# EasyEDA schematic cube-esp32-c6-easyeda-sch.json
TITLE: Alphabet Blocks; REV: 1.0; Date: 2024-02-08; Sheet: 1/1; Drawn By: stephen5.ng; Company: Stephen Ng
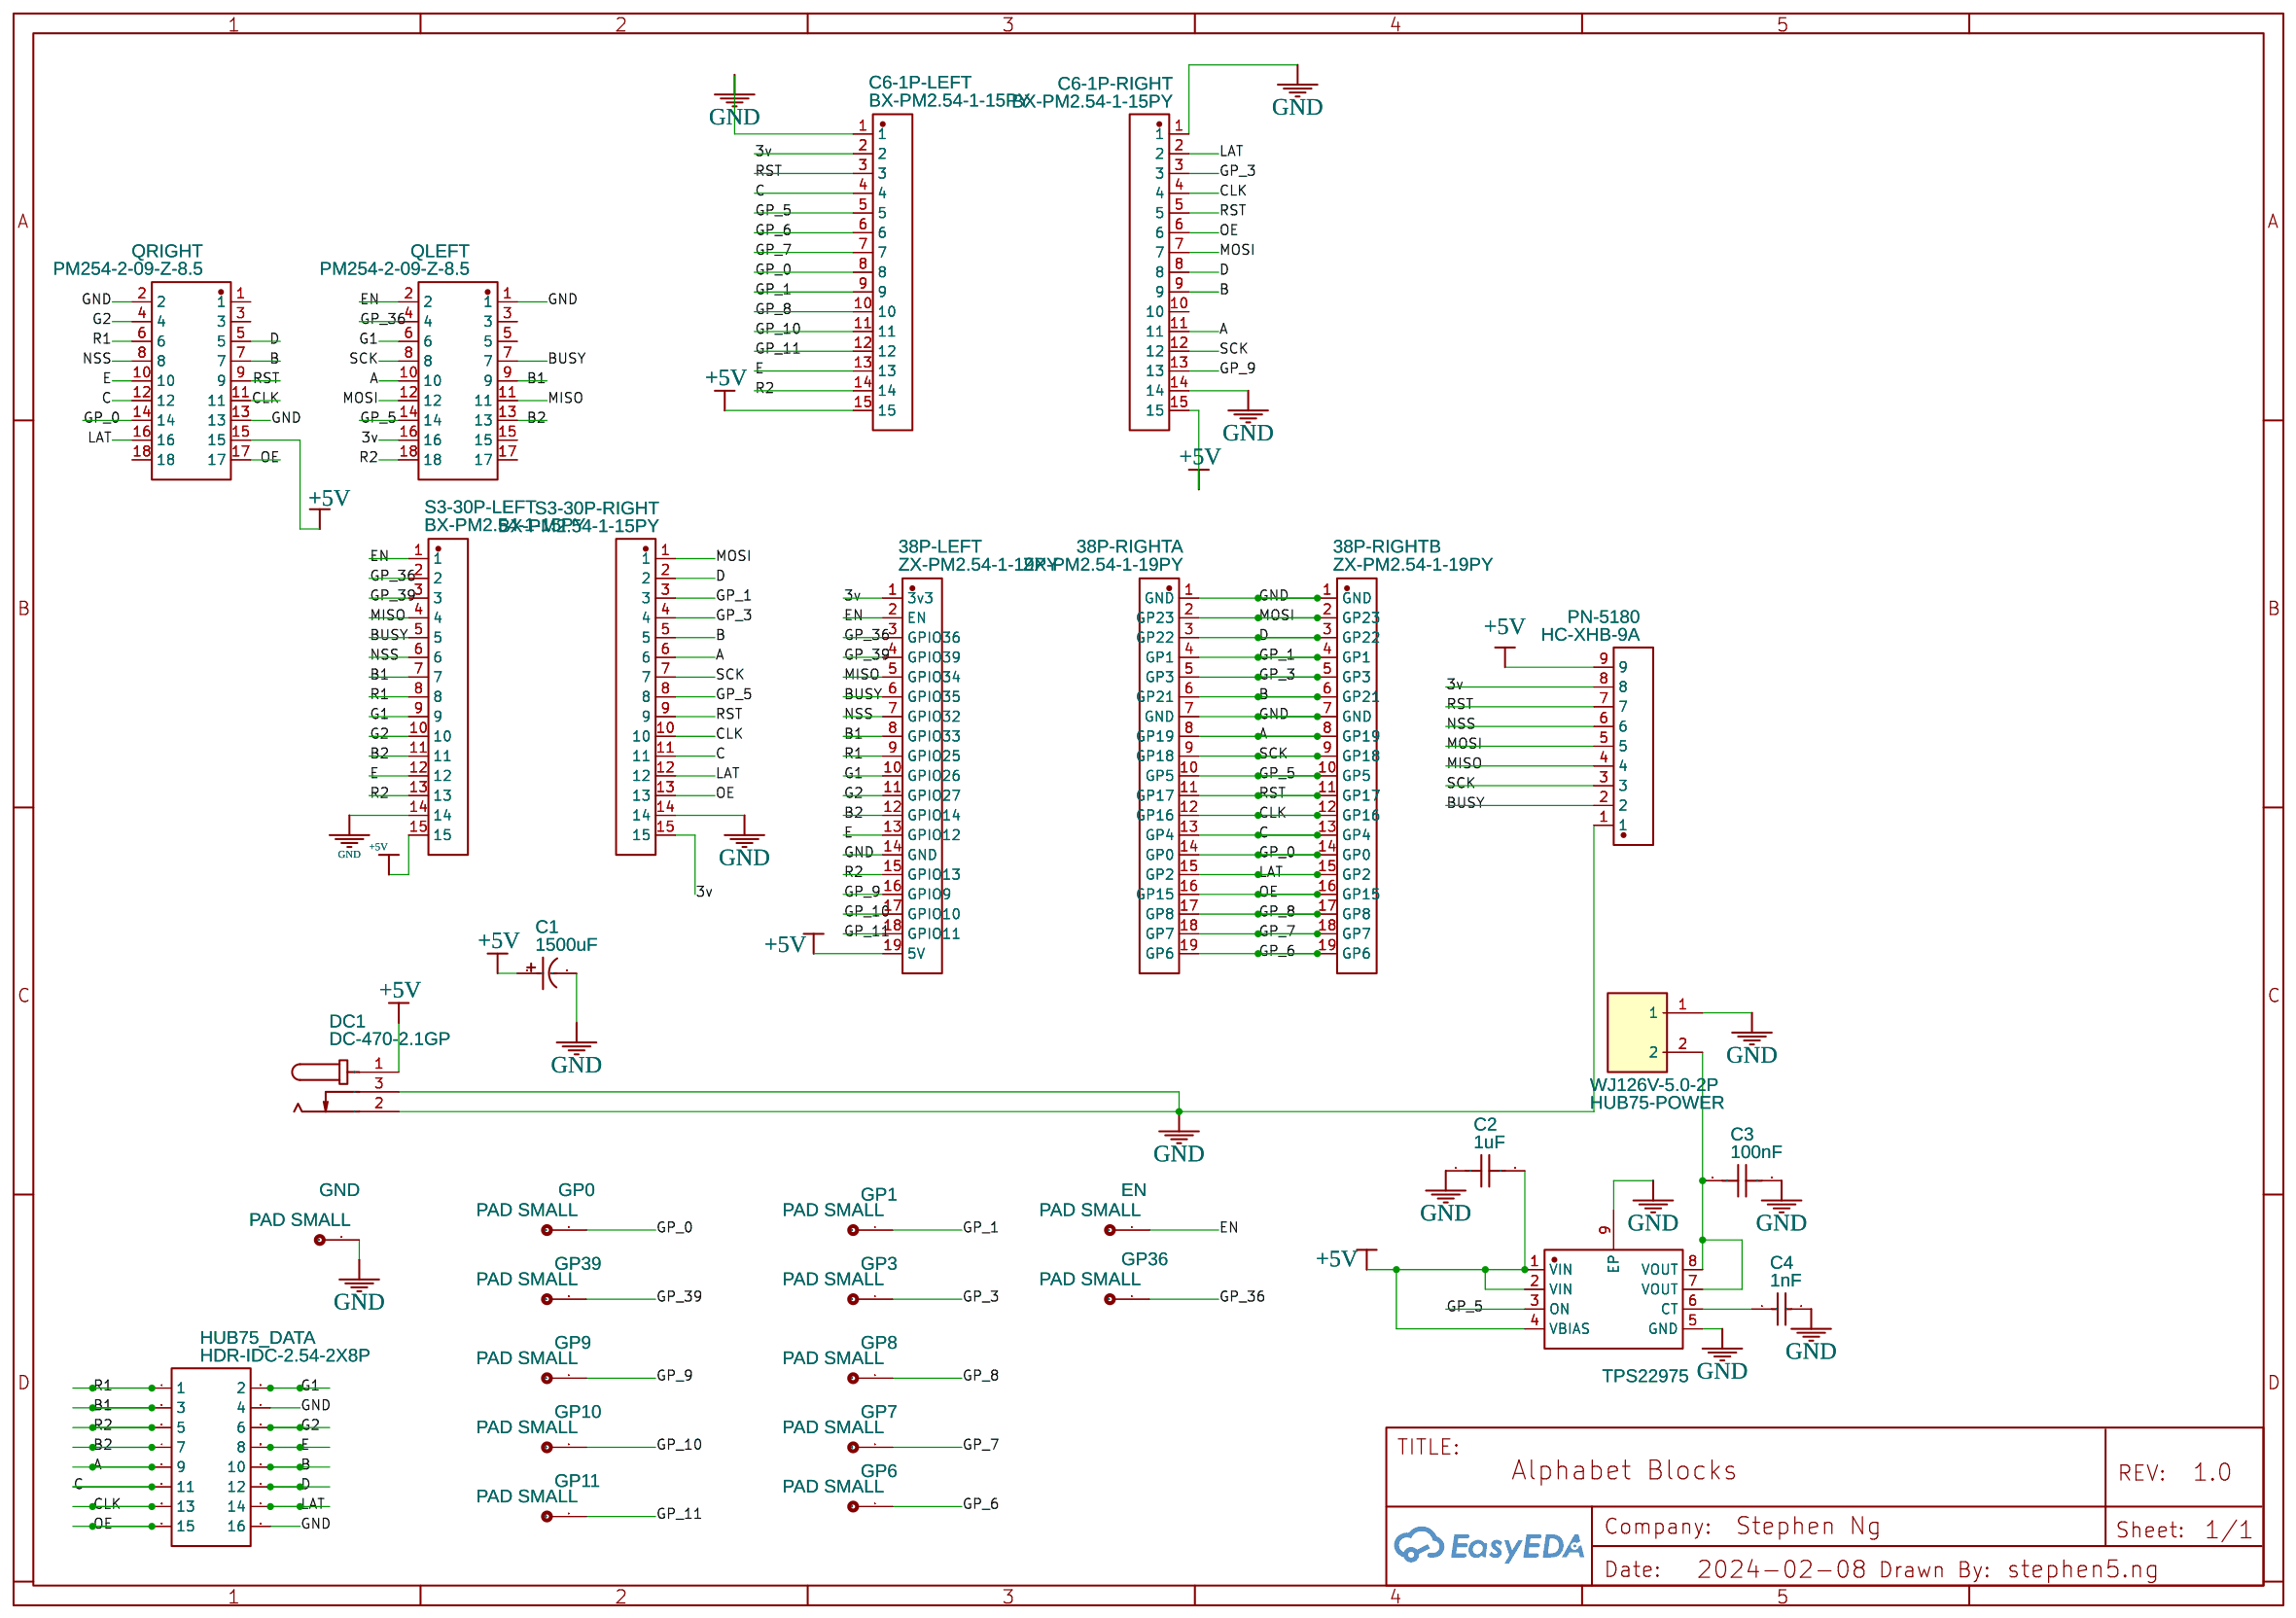
[diagram p0: schematic sheet]

## Parts
38P-LEFT  ZX-PM2.54-1-19PY  [HDR-TH_19P-P2.54-V-F]
38P-RIGHTA  ZX-PM2.54-1-19PY  [HDR-TH_19P-P2.54-V-F]
38P-RIGHTB  ZX-PM2.54-1-19PY  [HDR-TH_19P-P2.54-V-F]
C1  1500uF  [CAP-TH_BD10.0-P5.00-D1.0-FD]
C2  1uF  [C0402]
C3  100nF  [C0402]
C4  1nF  [C0402]
C6-1P-LEFT  BX-PM2.54-1-15PY  [HDR-TH_15P-P2.54-V-F-1]
C6-1P-RIGHT  BX-PM2.54-1-15PY  [HDR-TH_15P-P2.54-V-F-1]
DC1  DC-470-2.1GP  [DC-IN-TH_DC-470-2.1GP]
EN  PAD SMALL  [PADPAD]
GND  PAD SMALL  [PADPAD]
GP0  PAD SMALL  [PADPAD]
GP1  PAD SMALL  [PADPAD]
GP3  PAD SMALL  [PADPAD]
GP6  PAD SMALL  [PADPAD]
GP7  PAD SMALL  [PADPAD]
GP8  PAD SMALL  [PADPAD]
GP9  PAD SMALL  [PADPAD]
GP10  PAD SMALL  [PADPAD]
GP11  PAD SMALL  [PADPAD]
GP36  PAD SMALL  [PADPAD]
GP39  PAD SMALL  [PADPAD]
HUB75-POWER  WJ126V-5.0-2P  [CONN-TH_WJ126V-5.0-2P]
HUB75_DATA  HDR-IDC-2.54-2X8P  [IDC-TH_16P-P2.54_C3406]
PN-5180  HC-XHB-9A  [CONN-TH_9P_P2.50_HCTL_HC-XHB-9A]
QLEFT  PM254-2-09-Z-8.5  [HDR-TH_18P-P2.54-V-F-R2-C9-S2.54]
QRIGHT  PM254-2-09-Z-8.5  [HDR-TH_18P-P2.54-V-F-R2-C9-S2.54]
S  TPS22975  [WSON-8_L2.0-W2.0-P0.50-TL-EP]
S3-30P-LEFT  BX-PM2.54-1-15PY  [HDR-TH_15P-P2.54-V-F-1]
S3-30P-RIGHT  BX-PM2.54-1-15PY  [HDR-TH_15P-P2.54-V-F-1]

## Library data of the parts
38P-LEFT 38P-RIGHTA 38P-RIGHTB = ZX-PM2.54-1-19PY: Supplier: LCSC; Supplier Part: C7499335; Manufacturer: Megastar(兆星); Contributor: lcsc; JLCPCB Part Class: Extended Part
C1 = 16ZLH1500MEFC10X20: Contributor: LCSC; Package Display: No
C2 = CL05A105KA5NQNC: Supplier: LCSC; Manufacturer: SAMSUNG(三星); Supplier Part: C52923; JLCPCB Part Class: Basic Part
C3 = CL05B104KO5NNNC: Supplier: LCSC; Manufacturer: SAMSUNG(三星); Supplier Part: C1525; JLCPCB Part Class: Basic Part
C4 = 0402B102K500NT: Supplier: LCSC; Manufacturer: FH(风华); Supplier Part: C1523; JLCPCB Part Class: Basic Part
C6-1P-LEFT C6-1P-RIGHT S3-30P-LEFT S3-30P-RIGHT = BX-PM2.54-1-15PY: Supplier: LCSC; Supplier Part: C18078136; Manufacturer: Bossie(博锡); Contributor: lcsc; JLCPCB Part Class: Extended Part
DC1 = DC-470-2.1GP: Contributor: LCSC; Supplier: LCSC; Supplier Part: C194407; Manufacturer: GANGYUAN(港源); JLCPCB Part Class: Extended Part
EN GND GP0 GP1 GP3 GP6-GP11 GP36 GP39 = PAD SMALL: Contributor: Tellon
HUB75-POWER = WJ126V-5.0-2P: Supplier: LCSC; Manufacturer: KANGNEX(康奈克斯电气); Supplier Part: C8404; JLCPCB Part Class: Extended Part
HUB75_DATA = HDR-IDC-2.54-2X8P: Supplier: LCSC; Manufacturer: BOOMELE(博穆精密); Manufacturer Part: 2.54-2*8P简牛; Supplier Part: C3406; JLCPCB Part Class: Extended Part
PN-5180 = HC-XHB-9A: Contributor: LCSC; Supplier: LCSC; Supplier Part: C2845497; Manufacturer: HCTL(华灿天禄); JLCPCB Part Class: Extended Part
QLEFT QRIGHT = PM254-2-09-Z-8.5: Contributor: LCSC; Supplier: LCSC; Supplier Part: C2897410; Manufacturer: HCTL(华灿天禄); JLCPCB Part Class: Extended Part
S = TPS22975DSGR: Contributor: LCSC; Supplier: LCSC; Supplier Part: C524777; Manufacturer: TI(德州仪器); JLCPCB Part Class: Extended Part

## Nets
3v: 38P-LEFT.1(3v3) C6-1P-LEFT.2 PN-5180.8 QLEFT.16 S3-30P-RIGHT.15
+5V: 38P-LEFT.19(5V) C1.1 C2.2 C6-1P-LEFT.15 C6-1P-RIGHT.15 DC1.1 PN-5180.9 QRIGHT.15 S.1(VIN) S.2(VIN) S.4(VBIAS) S3-30P-LEFT.15
GND: 38P-LEFT.14(GND) 38P-RIGHTA.1(GND) 38P-RIGHTA.7(GND) 38P-RIGHTB.1(GND) 38P-RIGHTB.7(GND) C1.2 C2.1 C3.2 C4.2 C6-1P-LEFT.1 C6-1P-RIGHT.1 C6-1P-RIGHT.14 DC1.2 DC1.3 GND.1(Pad) HUB75-POWER.1 HUB75_DATA.4 HUB75_DATA.16 PN-5180.1 QLEFT.1 QRIGHT.2 QRIGHT.13 S.5(GND) S.9(EP) S3-30P-LEFT.14 S3-30P-RIGHT.14
A: 38P-RIGHTA.8(GP19) 38P-RIGHTB.8(GP19) C6-1P-RIGHT.11 HUB75_DATA.9 QLEFT.10 S3-30P-RIGHT.6
B: 38P-RIGHTA.6(GP21) 38P-RIGHTB.6(GP21) C6-1P-RIGHT.9 HUB75_DATA.10 QRIGHT.7 S3-30P-RIGHT.5
B1: 38P-LEFT.8(GPIO33) HUB75_DATA.3 QLEFT.9 S3-30P-LEFT.7
B2: 38P-LEFT.12(GPIO14) HUB75_DATA.7 QLEFT.13 S3-30P-LEFT.11
BUSY: 38P-LEFT.6(GPIO35) PN-5180.2 QLEFT.7 S3-30P-LEFT.5
C: 38P-RIGHTA.13(GP4) 38P-RIGHTB.13(GP4) C6-1P-LEFT.4 HUB75_DATA.11 QRIGHT.12 S3-30P-RIGHT.11
CLK: 38P-RIGHTA.12(GP16) 38P-RIGHTB.12(GP16) C6-1P-RIGHT.4 HUB75_DATA.13 QRIGHT.11 S3-30P-RIGHT.10
D: 38P-RIGHTA.3(GP22) 38P-RIGHTB.3(GP22) C6-1P-RIGHT.8 HUB75_DATA.12 QRIGHT.5 S3-30P-RIGHT.2
E: 38P-LEFT.13(GPIO12) C6-1P-LEFT.13 HUB75_DATA.8 QRIGHT.10 S3-30P-LEFT.12
EN: 38P-LEFT.2(EN) EN.1(Pad) QLEFT.2 S3-30P-LEFT.1
G1: 38P-LEFT.10(GPIO26) HUB75_DATA.2 QLEFT.6 S3-30P-LEFT.9
G2: 38P-LEFT.11(GPIO27) HUB75_DATA.6 QRIGHT.4 S3-30P-LEFT.10
GP_0: 38P-RIGHTA.14(GP0) 38P-RIGHTB.14(GP0) C6-1P-LEFT.8 GP0.1(Pad) QRIGHT.14
GP_1: 38P-RIGHTA.4(GP1) 38P-RIGHTB.4(GP1) C6-1P-LEFT.9 GP1.1(Pad) S3-30P-RIGHT.3
GP_3: 38P-RIGHTA.5(GP3) 38P-RIGHTB.5(GP3) C6-1P-RIGHT.3 GP3.1(Pad) S3-30P-RIGHT.4
GP_5: 38P-RIGHTA.10(GP5) 38P-RIGHTB.10(GP5) C6-1P-LEFT.5 QLEFT.14 S.3(ON) S3-30P-RIGHT.8
GP_6: 38P-RIGHTA.19(GP6) 38P-RIGHTB.19(GP6) C6-1P-LEFT.6 GP6.1(Pad)
GP_7: 38P-RIGHTA.18(GP7) 38P-RIGHTB.18(GP7) C6-1P-LEFT.7 GP7.1(Pad)
GP_8: 38P-RIGHTA.17(GP8) 38P-RIGHTB.17(GP8) C6-1P-LEFT.10 GP8.1(Pad)
GP_9: 38P-LEFT.16(GPIO9) C6-1P-RIGHT.13 GP9.1(Pad)
GP_10: 38P-LEFT.17(GPIO10) C6-1P-LEFT.11 GP10.1(Pad)
GP_11: 38P-LEFT.18(GPIO11) C6-1P-LEFT.12 GP11.1(Pad)
GP_36: 38P-LEFT.3(GPIO36) GP36.1(Pad) QLEFT.4 S3-30P-LEFT.2
GP_39: 38P-LEFT.4(GPIO39) GP39.1(Pad) S3-30P-LEFT.3
LAT: 38P-RIGHTA.15(GP2) 38P-RIGHTB.15(GP2) C6-1P-RIGHT.2 HUB75_DATA.14 QRIGHT.16 S3-30P-RIGHT.12
MISO: 38P-LEFT.5(GPIO34) PN-5180.4 QLEFT.11 S3-30P-LEFT.4
MOSI: 38P-RIGHTA.2(GP23) 38P-RIGHTB.2(GP23) C6-1P-RIGHT.7 PN-5180.5 QLEFT.12 S3-30P-RIGHT.1
NSS: 38P-LEFT.7(GPIO32) PN-5180.6 QRIGHT.8 S3-30P-LEFT.6
OE: 38P-RIGHTA.16(GP15) 38P-RIGHTB.16(GP15) C6-1P-RIGHT.6 HUB75_DATA.15 QRIGHT.17 S3-30P-RIGHT.13
R1: 38P-LEFT.9(GPIO25) HUB75_DATA.1 QRIGHT.6 S3-30P-LEFT.8
R2: 38P-LEFT.15(GPIO13) C6-1P-LEFT.14 HUB75_DATA.5 QLEFT.18 S3-30P-LEFT.13
RST: 38P-RIGHTA.11(GP17) 38P-RIGHTB.11(GP17) C6-1P-LEFT.3 C6-1P-RIGHT.5 PN-5180.7 QRIGHT.9 S3-30P-RIGHT.9
SCK: 38P-RIGHTA.9(GP18) 38P-RIGHTB.9(GP18) C6-1P-RIGHT.12 PN-5180.3 QLEFT.8 S3-30P-RIGHT.7
Net-(C3-1): C3.1 HUB75-POWER.2 S.7(VOUT) S.8(VOUT)
Net-(C4-1): C4.1 S.6(CT)

Not connected (* = marked no-connect by the designer): C6-1P-RIGHT 10; QLEFT 3 5 15 17; QRIGHT 1 3 18
